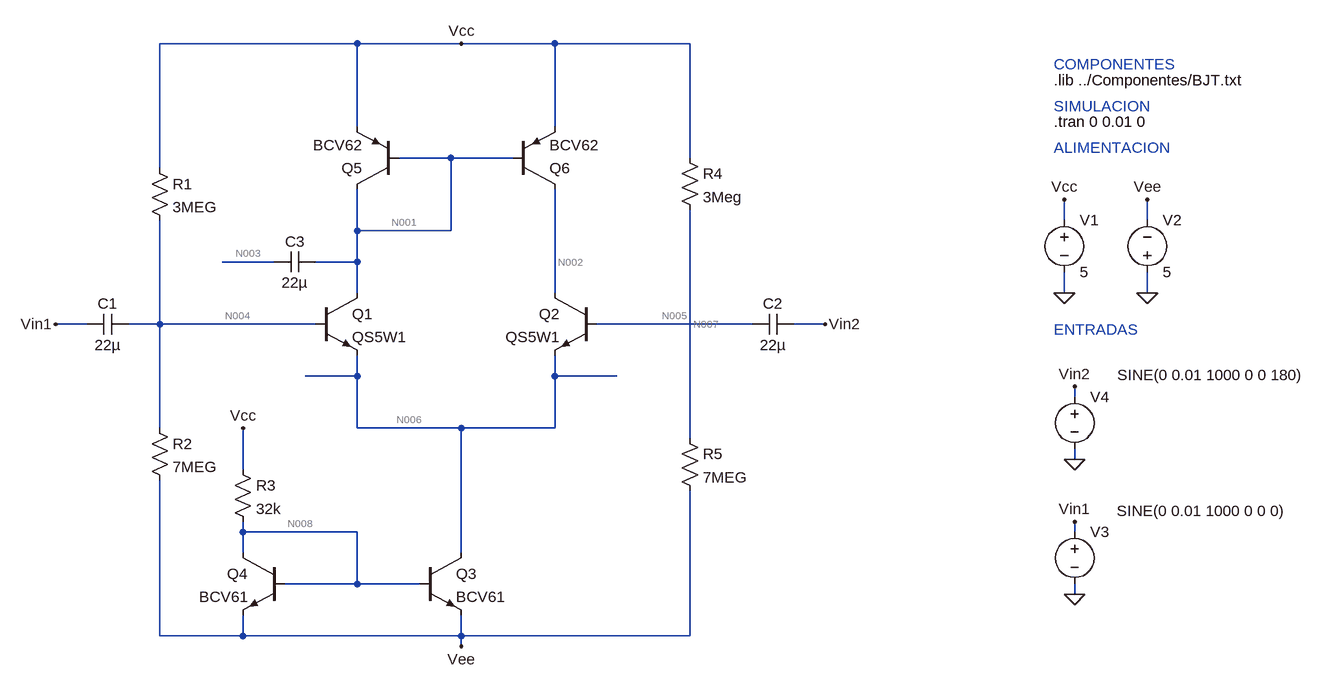
[diagram p0: schematic bjt_act_load.asc]
bjt_act_load.asc, the LTspice schematic file:
Version 4
SHEET 1 1364 828
WIRE -128 -240 -432 -240
WIRE 32 -240 -128 -240
WIRE 176 -240 32 -240
WIRE 384 -240 176 -240
WIRE 176 -176 176 -240
WIRE -128 -160 -128 -240
WIRE -128 -112 -128 -160
WIRE 176 -112 176 -176
WIRE 16 -64 -64 -64
WIRE 112 -64 16 -64
WIRE 384 -64 384 -240
WIRE -432 -48 -432 -240
WIRE 960 32 960 0
WIRE 1088 32 1088 0
WIRE -128 48 -128 -16
WIRE 16 48 16 -64
WIRE 16 48 -128 48
WIRE 176 48 176 -16
WIRE -256 96 -336 96
WIRE -128 96 -128 48
WIRE -128 96 -192 96
WIRE -128 144 -128 96
WIRE 176 144 176 48
WIRE 960 144 960 112
WIRE 1088 144 1088 112
WIRE -544 192 -592 192
WIRE -432 192 -432 32
WIRE -432 192 -480 192
WIRE -192 192 -432 192
WIRE 480 192 240 192
WIRE 592 192 544 192
WIRE -128 272 -128 240
WIRE -128 272 -208 272
WIRE 176 272 176 240
WIRE 272 272 176 272
WIRE 976 304 976 288
WIRE -432 352 -432 192
WIRE -128 352 -128 272
WIRE 32 352 -128 352
WIRE 176 352 176 272
WIRE 176 352 32 352
WIRE 384 368 384 16
WIRE -304 384 -304 352
WIRE 976 400 976 384
WIRE -304 416 -304 384
WIRE 32 464 32 352
WIRE -304 512 -304 496
WIRE -128 512 -304 512
WIRE 976 512 976 496
WIRE -304 544 -304 512
WIRE 32 544 32 464
WIRE -128 592 -128 512
WIRE -128 592 -240 592
WIRE -32 592 -128 592
WIRE 976 608 976 592
WIRE -432 672 -432 432
WIRE -304 672 -304 640
WIRE -304 672 -432 672
WIRE 32 672 32 640
WIRE 32 672 -304 672
WIRE 384 672 384 448
WIRE 384 672 32 672
WIRE 32 688 32 672
FLAG 960 144 0
FLAG 1088 144 0
FLAG 960 0 Vcc
FLAG 1088 0 Vee
FLAG 32 -240 Vcc
FLAG 32 688 Vee
FLAG -304 352 Vcc
FLAG 976 400 0
FLAG 976 608 0
FLAG -592 192 Vin1
FLAG 976 496 Vin1
FLAG 976 288 Vin2
FLAG 592 192 Vin2
DATAFLAG -208 272 ""
DATAFLAG 272 272 ""
DATAFLAG 32 464 "Ic(Q3)"
DATAFLAG 176 48 ""
DATAFLAG 176 -176 "I(R2)"
DATAFLAG -304 384 "I(R3)"
DATAFLAG -128 -160 "I(R1)"
SYMBOL npn -192 144 R0
SYMATTR InstName Q1
SYMATTR Value QS5W1
SYMBOL npn 240 144 M0
SYMATTR InstName Q2
SYMATTR Value QS5W1
SYMBOL voltage 960 16 R0
WINDOW 123 0 0 Left 2
WINDOW 39 0 0 Left 2
SYMATTR InstName V1
SYMATTR Value 5
SYMBOL voltage 1088 128 M180
WINDOW 0 24 96 Left 2
WINDOW 3 24 16 Left 2
WINDOW 123 0 0 Left 2
WINDOW 39 0 0 Left 2
SYMATTR InstName V2
SYMATTR Value 5
SYMBOL voltage 976 496 R0
WINDOW 3 65 -17 Left 2
WINDOW 123 0 0 Left 2
WINDOW 39 0 0 Left 2
SYMATTR Value SINE(0 0.01 1000 0 0 0)
SYMATTR InstName V3
SYMBOL voltage 976 288 R0
WINDOW 3 66 -18 Left 2
WINDOW 123 0 0 Left 2
WINDOW 39 0 0 Left 2
SYMATTR Value SINE(0 0.01 1000 0 0 180)
SYMATTR InstName V4
SYMBOL npn -32 544 R0
SYMATTR InstName Q3
SYMATTR Value BCV61
SYMBOL npn -240 544 M0
SYMATTR InstName Q4
SYMATTR Value BCV61
SYMBOL res -320 400 R0
SYMATTR InstName R3
SYMATTR Value 32k
SYMBOL pnp -64 -16 R180
SYMATTR InstName Q5
SYMATTR Value BCV62
SYMBOL pnp 112 -16 M180
SYMATTR InstName Q6
SYMATTR Value BCV62
SYMBOL cap -480 176 R90
WINDOW 0 0 32 VBottom 2
WINDOW 3 32 32 VTop 2
SYMATTR InstName C1
SYMATTR Value 22µ
SYMBOL cap 544 176 R90
WINDOW 0 0 32 VBottom 2
WINDOW 3 32 32 VTop 2
SYMATTR InstName C2
SYMATTR Value 22µ
SYMBOL res -448 -64 R0
SYMATTR InstName R1
SYMATTR Value 3MEG
SYMBOL res -448 336 R0
SYMATTR InstName R2
SYMATTR Value 7MEG
SYMBOL res 368 -80 R0
SYMATTR InstName R4
SYMATTR Value 3Meg
SYMBOL res 368 352 R0
SYMATTR InstName R5
SYMATTR Value 7MEG
SYMBOL cap -192 80 R90
WINDOW 0 0 32 VBottom 2
WINDOW 3 32 32 VTop 2
SYMATTR InstName C3
SYMATTR Value 22µ
TEXT 944 -184 Left 2 !.lib ../Componentes/BJT.txt
TEXT 944 -120 Left 2 !.tran 0 0.01 0
TEXT 944 -208 Left 2 ;COMPONENTES
TEXT 944 -144 Left 2 ;SIMULACION
TEXT 944 -80 Left 2 ;ALIMENTACION
TEXT 944 200 Left 2 ;ENTRADAS

The netlist it stands for:
* bjt_act_load.asc
Q1 N001 N004 N006 0 QS5W1
Q2 N002 N005 N006 0 QS5W1
V1 Vcc 0 5
V2 0 Vee 5
V3 Vin1 0 SINE(0 0.01 1000 0 0 0)
V4 Vin2 0 SINE(0 0.01 1000 0 0 180)
Q3 N006 N008 Vee 0 BCV61
Q4 N008 N008 Vee 0 BCV61
R3 Vcc N008 32k
Q5 N001 N001 Vcc 0 BCV62
Q6 N002 N001 Vcc 0 BCV62
C1 N004 Vin1 22µ
C2 Vin2 N005 22µ
R1 Vcc N004 3MEG
R2 N004 Vee 7MEG
R4 Vcc N007 3Meg
R5 N007 Vee 7MEG
C3 N001 N003 22µ
.model NPN NPN
.model PNP PNP
.lib standard.bjt
.lib ../Componentes/BJT.txt
.tran 0 0.01 0
* COMPONENTES
* SIMULACION
* ALIMENTACION
* ENTRADAS
.backanno
.end

* Results of the author's LTspice run, read from the files saved beside the schematic
* Operating Point, zero values left out:
*   V(n001) = 4.4 V
*   V(n004) = 35.06 mV
*   V(n006) = -486.7 mV
*   V(n002) = 4.993 V
*   V(n005) = -319.4 mV
*   V(vcc) = 5 V
*   V(vee) = -5 V
*   V(n008) = -4.395 V
*   V(n007) = 2 V
*   V(n003) = 96.79 µV
*   Ic(Q6) = -393.4 pA
*   Ib(Q6) = -27.02 µA
*   Ie(Q6) = 27.02 µA
*   Ic(Q5) = -277 µA
*   Ib(Q5) = -1.098 µA
*   Ie(Q5) = 278 µA
*   Ic(Q4) = 291.7 µA
*   Ib(Q4) = 938.4 nA
*   Ie(Q4) = -292.7 µA
*   Ic(Q3) = 306 µA
*   Ib(Q3) = 938.1 nA
*   Ie(Q3) = -306.9 µA
*   Ic(Q2) = 393.4 pA
*   Ie(Q2) = -393.4 pA
*   Ic(Q1) = 305.1 µA
*   Ib(Q1) = 935.7 nA
*   Ie(Q1) = -306 µA
*   I(R5) = 1 µA
*   I(R4) = 1 µA
*   I(R2) = 719.3 nA
*   I(R1) = 1.655 µA
*   I(R3) = 293.6 µA
*   I(V2) = -601.3 µA
*   I(V1) = -601.3 µA
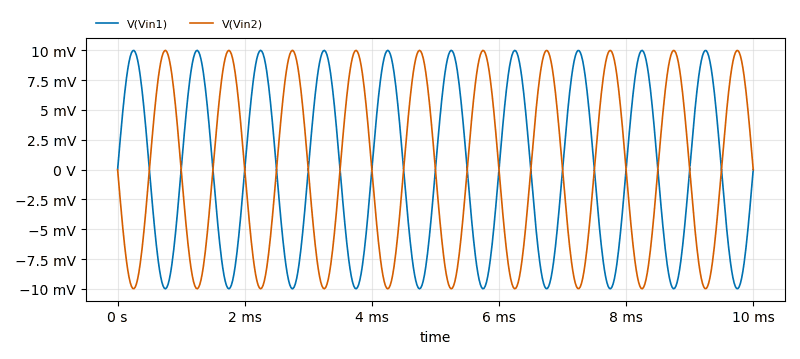
[diagram p1: Transient Analysis of bjt_act_load.asc, plotted from the saved traces]
* Transient Analysis, 1 run:
*   V(Vin1): min -9.99 mV, max 9.99 mV, average -93.25 nV, rms 7.076 mV, last 0 V
*   V(Vin2): min -9.99 mV, max 9.99 mV, average 93.25 nV, rms 7.076 mV, last 0 V